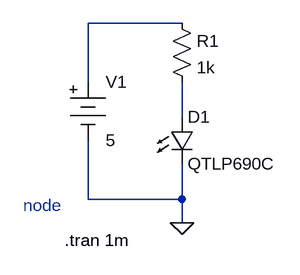
[diagram p0: schematic ani.asc]
ani.asc, the LTspice schematic file:
Version 4
SHEET 1 880 680
WIRE 272 32 144 32
WIRE 144 112 144 32
WIRE 272 160 272 112
WIRE 144 272 144 192
WIRE 272 272 272 224
WIRE 272 272 144 272
WIRE 272 304 272 272
FLAG 272 304 0
SYMBOL Misc\\battery 144 96 R0
SYMATTR InstName V1
SYMATTR Value 5
SYMBOL res 256 16 R0
SYMATTR InstName R1
SYMATTR Value 1k
SYMBOL LED 256 160 R0
SYMATTR InstName D1
SYMATTR Value QTLP690C
TEXT 112 328 Left 2 !.tran 1m
TEXT 56 280 Left 2 ;node

The netlist it stands for:
* ani.asc
V1 N001 0 5
R1 N001 N002 1k
D1 N002 0 QTLP690C
.model D D
.lib standard.dio
.tran 1m
* node
.backanno
.end